# EAGLE design battery (EAGLE 9.6.2)
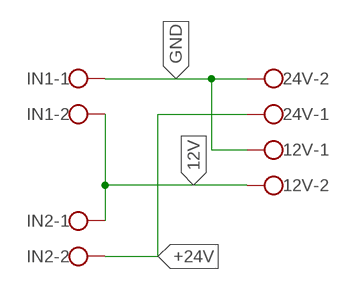
[diagram p0: schematic, sheet 1]

## Parts
12V  W237-113  [W237-113]
24V  W237-113  [W237-113]
IN1  W237-113  [W237-113]
IN2  W237-113  [W237-113]

## Nets
12V: 12V.2 IN1.2 IN2.1
+24V: 24V.1 IN2.2
GND: 12V.1 24V.2 IN1.1

## Library data of the parts
12V 24V IN1 IN2 = con-wago-500:W237-113: WAGO SCREW CLAMP; OC_FARNELL: unknown; OC_NEWARK: unknown

## Board
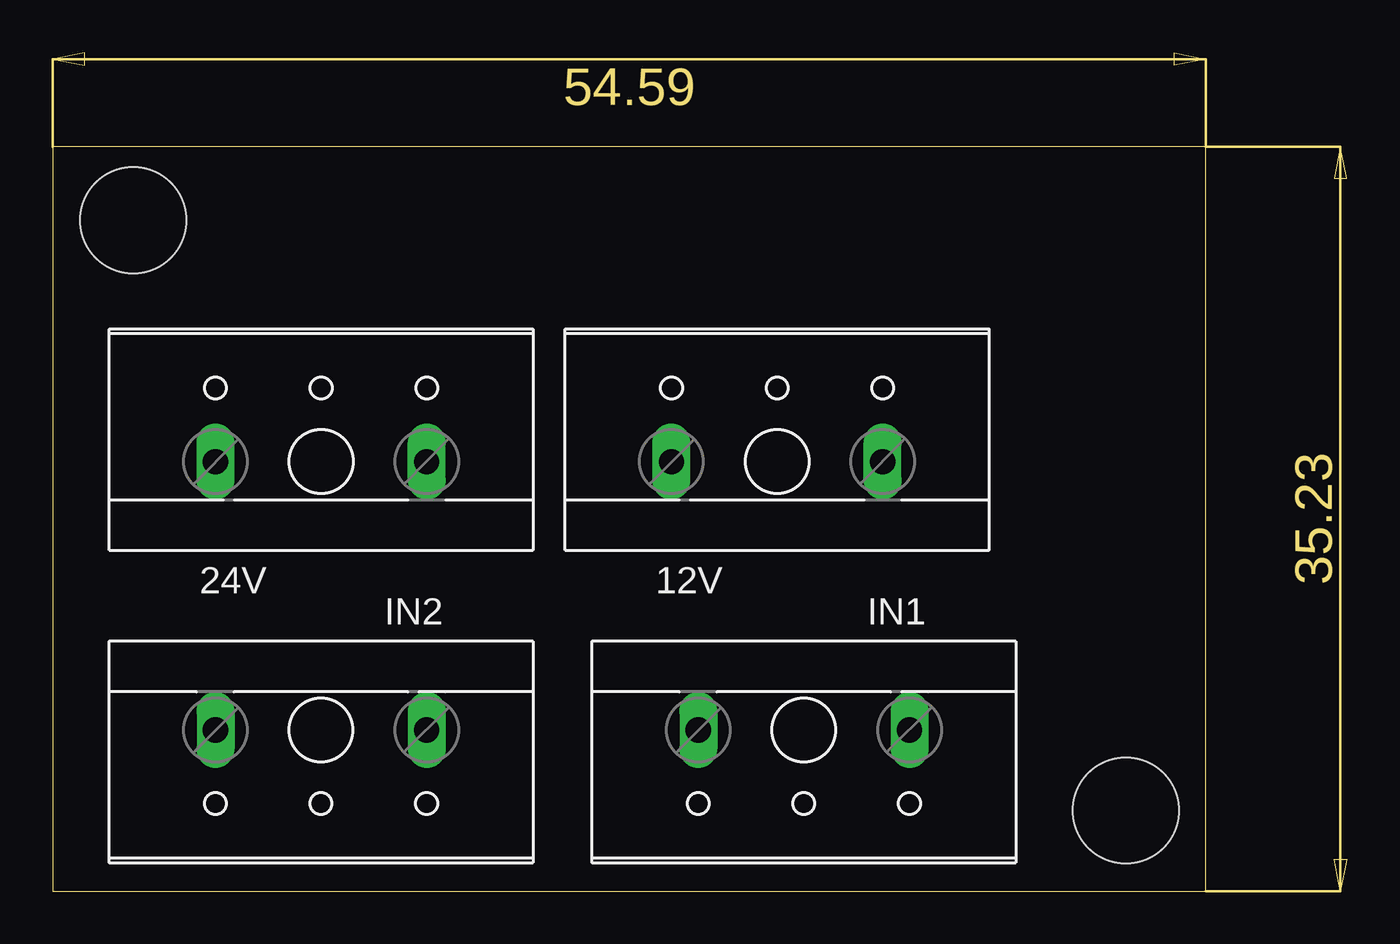
[diagram p1: board, top side]
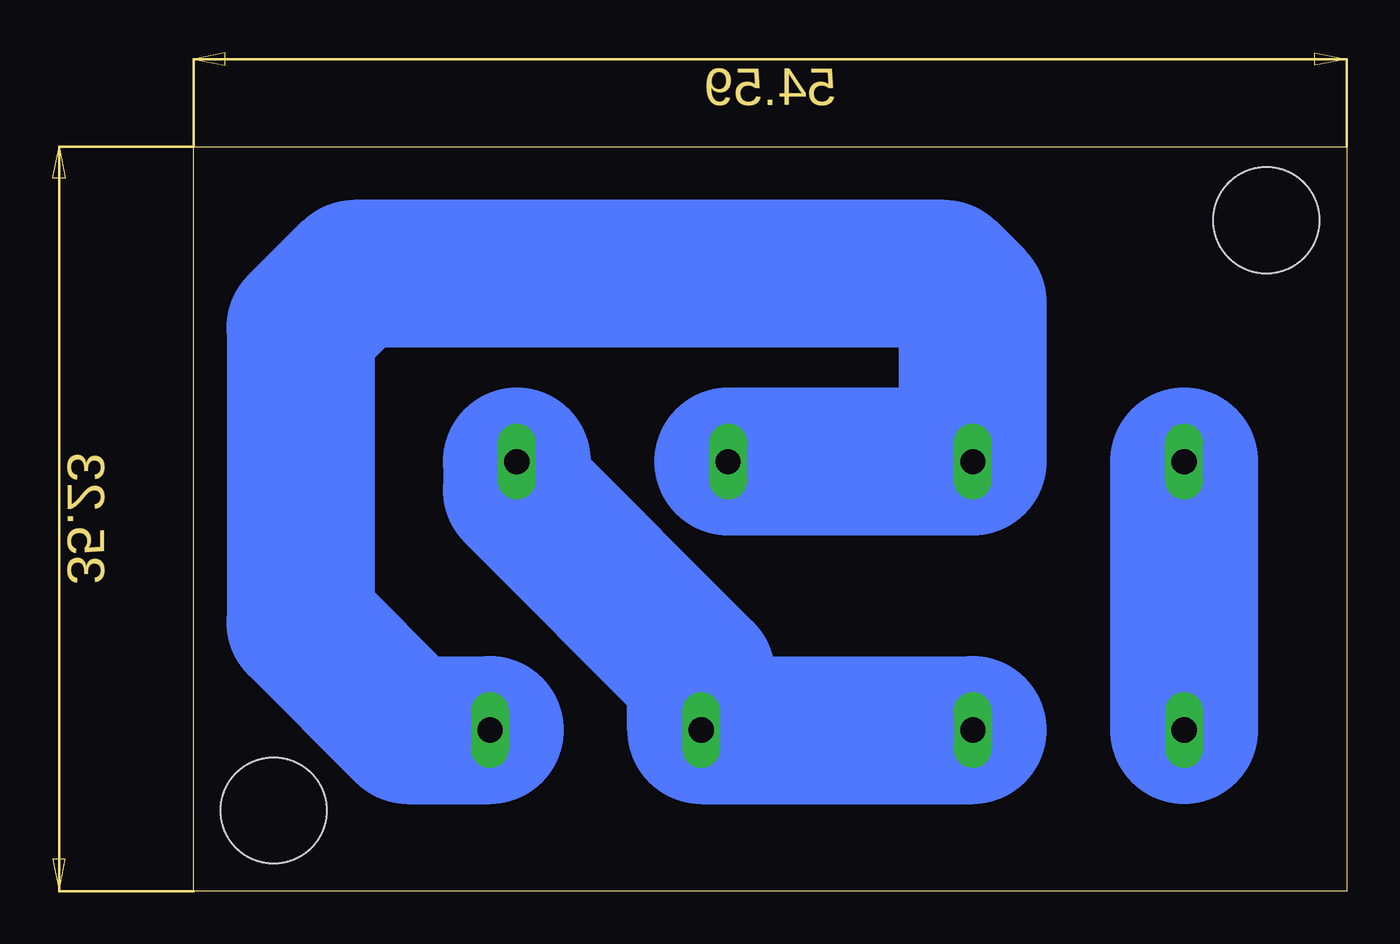
[diagram p2: board, bottom side, seen from below]

Size 54.59 x 35.23 mm. Coordinates in mm from the lower left corner, seen from the top.
Outline: 0,0 54.59,0 54.59,35.23 0,35.23 0,0
Copper layers (1*16): Top 0.035mm / dielectric 1.5mm / Bottom 0.035mm
Design rules "default": minimum track width 6mil, minimum drill 0.35mm, track to track 6mil, track to pad 6mil, pad to pad 6mil, via to via 6mil, smd to smd 6mil, copper to edge 40mil, drill to drill 6mil, minimum pad ring 10mil, minimum via ring 8mil, stop-mask expansion 4mil, vias tented up to drill 0mil, thermal gap 10mil
Holes 5 mm at 3.81,31.75 50.8,3.81

### Footprints (pad centres in the part's own frame; a part is rotated, then mirrored left to right if it is on the bottom)
W237-113 = drill 1.194 long: 1 -5,-1.27; 2 5,-1.27

### Placement (x,y rotation side)
12V  34.29,21.59 0 top
24V  12.7,21.59 0 top
IN1  35.56,6.35 180 top
IN2  12.7,6.35 180 top

### Tracks (layer width: path | path; a pad name or v marks a point on that pad's centre or on a via)
12V
  Bottom 7: IN2.1 IN1.2 30.56,10.24 39.29,18.97 12V.2
+24V
  Bottom 7: 24V.1 IN2.2
GND
  Bottom 7: IN1.1 44.45,7.62 49.53,12.7 49.53,26.67 46.99,29.21 19.05,29.21 17.7,27.86 24V.2 12V.1